# Altium schematic sheet Colibri.SchDoc: Iris
size A3; Organization: Toradex AG; Address1: Altsagenstrasse 5; Address2: Horw; Address3: 6048; Address4: Switzerland; DocumentNumber: 4; Revision: V2.0; SheetNumber: 4; SheetTotal: 16
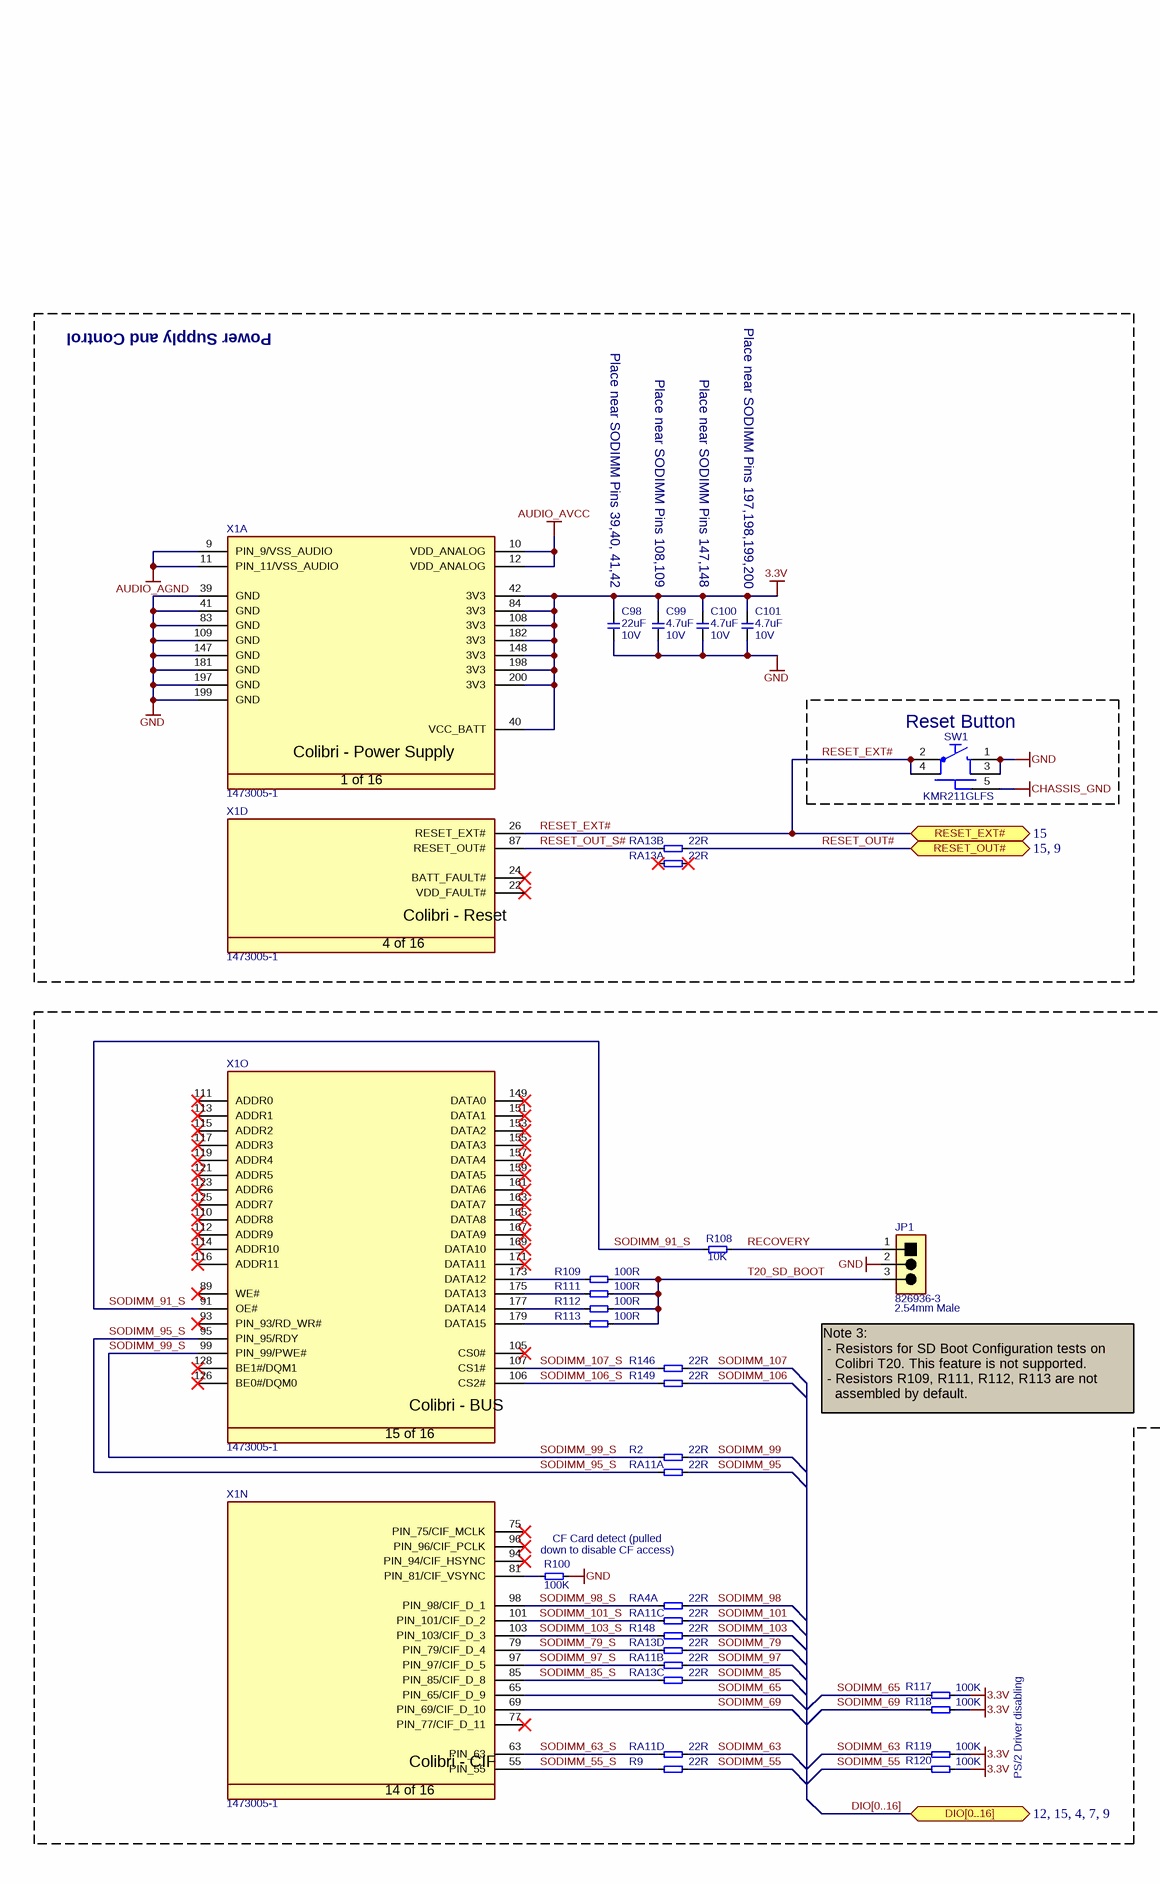
[diagram p0: Colibri.SchDoc, left]
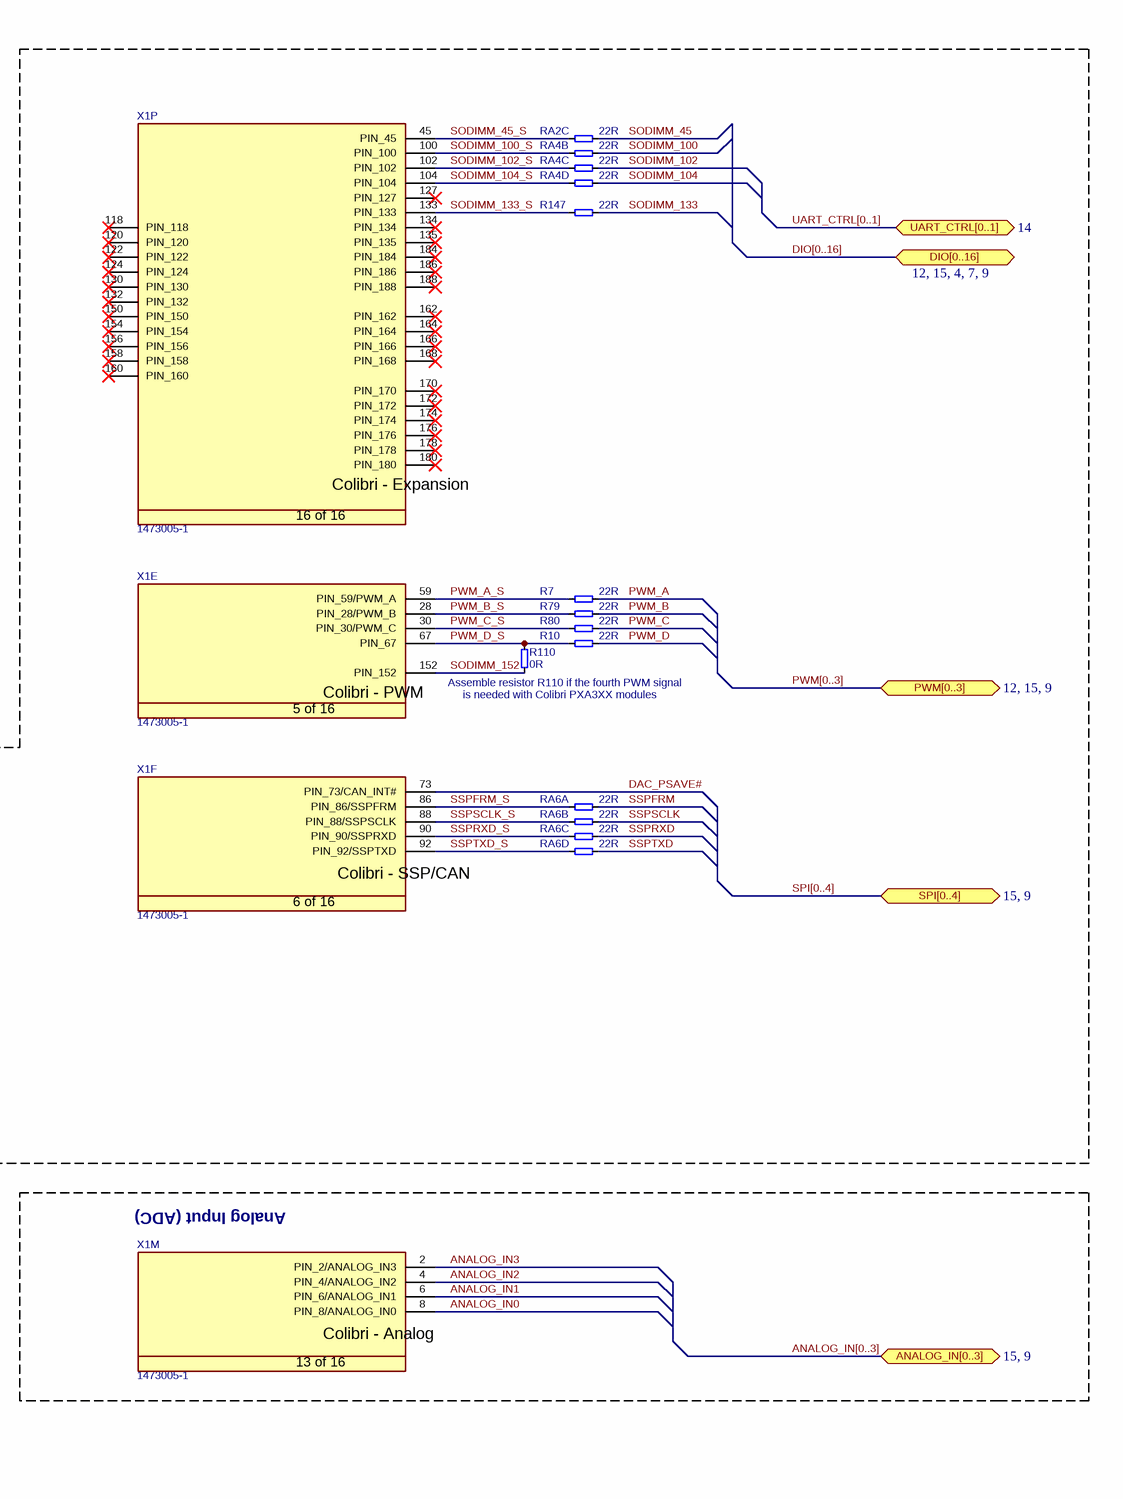
[diagram p1: Colibri.SchDoc, right]

## Parts
C98  Rating: 10V  [T_CAPC0805X125N]  (hidden comment: 22uF)
C99  Rating: 10V  [T_CAPC0603X33N]  (hidden comment: 4.7uF)
C100  Rating: 10V  [T_CAPC0603X33N]  (hidden comment: 4.7uF)
C101  Rating: 10V  [T_CAPC0603X33N]  (hidden comment: 4.7uF)
JP1  826936-3  [T_TYCO_826936-3]
R2  22R  [RESC1005X40N]
R7  22R  [RESC1005X40N]
R9  22R  [RESC1005X40N]
R10  22R  [RESC1005X40N]
R79  22R  [RESC1005X40N]
R80  22R  [RESC1005X40N]
R100  100K  [RESC1005X40N]
R108  10K  [RESC1005X40N]
R109  100R  [T_RESC0603X30N]
R110  0R  [T_RESC0603X30N]
R111  100R  [T_RESC0603X30N]
R112  100R  [T_RESC0603X30N]
R113  100R  [T_RESC0603X30N]
R117  100K  [RESC1005X40N]
R118  100K  [RESC1005X40N]
R119  100K  [RESC1005X40N]
R120  100K  [RESC1005X40N]
R146  22R  [RESC1005X40N]
R147  22R  [RESC1005X40N]
R148  22R  [RESC1005X40N]
R149  22R  [RESC1005X40N]
RA2  22R  [T_Resistor_Array_X4]  (part C of 4)
RA4  22R  [T_Resistor_Array_X4]  (parts A,B,C,D of 4)
RA6  22R  [T_Resistor_Array_X4]  (parts A,B,C,D of 4)
RA11  22R  [T_Resistor_Array_X4]  (parts A,B,C,D of 4)
RA13  22R  [T_Resistor_Array_X4]  (parts A,B,C,D of 4)
SW1  KMR211GLFS  [T_CnK_KMR211GLFS]
X1  1473005-1  [T_Tyco_1473005-1]  (parts A,D,E,F,M,N,O,P of 16)

## Blocks framed on the sheet
Power Supply and Control: C98-C101 RA13 X1
Reset Button: SW1
Analog Input (ADC): X1

## Ports
ANALOG_IN[0..3] (bidir, see 15, 9), DIO[0..16] (bidir, see 12, 15, 4, 7, 9), PWM[0..3] (bidir, see 12, 15, 9), RESET_EXT# (bidir, see 15), RESET_OUT# (bidir, see 15, 9), SPI[0..4] (bidir, see 15, 9), UART_CTRL[0..1] (bidir, see 14)

## Nets
3.3V: C98.2 C99.1 C100.1 C101.1 R117.1 R118.1 R119.1 R120.1 X1.40(VCC_BATT) X1.42(3V3) X1.84(3V3) X1.108(3V3) X1.148(3V3) X1.182(3V3) X1.198(3V3) X1.200(3V3)
AUDIO_AGND: X1.9(PIN_9/VSS_AUDIO) X1.11(PIN_11/VSS_AUDIO)
AUDIO_AVCC: X1.10(VDD_ANALOG) X1.12(VDD_ANALOG)
CHASSIS_GND: SW1.5
GND: C98.1 C99.2 C100.2 C101.2 JP1.2 R100.1 SW1.1 SW1.3 X1.39(GND) X1.41(GND) X1.83(GND) X1.109(GND) X1.147(GND) X1.181(GND) X1.197(GND) X1.199(GND)
ANALOG_IN0: X1.8(PIN_8/ANALOG_IN0)
ANALOG_IN1: X1.6(PIN_6/ANALOG_IN1)
ANALOG_IN2: X1.4(PIN_4/ANALOG_IN2)
ANALOG_IN3: X1.2(PIN_2/ANALOG_IN3)
DAC_PSAVE#: X1.73(PIN_73/CAN_INT#)
PWM_A: R7.2
PWM_A_S: R7.1 X1.59(PIN_59/PWM_A)
PWM_B: R79.2
PWM_B_S: R79.1 X1.28(PIN_28/PWM_B)
PWM_C: R80.2
PWM_C_S: R80.1 X1.30(PIN_30/PWM_C)
PWM_D: R10.2
PWM_D_S: R10.1 R110.1 X1.67(PIN_67)
RECOVERY: JP1.1 R108.2
RESET_EXT#: SW1.2 SW1.4 X1.26(RESET_EXT#) ; port RESET_EXT#
RESET_OUT#: RA13.6 ; port RESET_OUT#
RESET_OUT_S#: RA13.2 X1.87(RESET_OUT#)
SODIMM_45: RA2.7
SODIMM_45_S: RA2.3 X1.45(PIN_45)
SODIMM_55: R9.2 R120.2
SODIMM_55_S: R9.1 X1.55(PIN_55)
SODIMM_63: R119.2 RA11.8
SODIMM_63_S: RA11.4 X1.63(PIN_63)
SODIMM_65: R117.2 X1.65(PIN_65/CIF_D_9)
SODIMM_69: R118.2 X1.69(PIN_69/CIF_D_10)
SODIMM_79: RA13.8
SODIMM_79_S: RA13.4 X1.79(PIN_79/CIF_D_4)
SODIMM_85: RA13.7
SODIMM_85_S: RA13.3 X1.85(PIN_85/CIF_D_8)
SODIMM_91_S: R108.1 X1.91(OE#)
SODIMM_95: RA11.5
SODIMM_95_S: RA11.1 X1.95(PIN_95/RDY)
SODIMM_97: RA11.6
SODIMM_97_S: RA11.2 X1.97(PIN_97/CIF_D_5)
SODIMM_98: RA4.5
SODIMM_98_S: RA4.1 X1.98(PIN_98/CIF_D_1)
SODIMM_99: R2.2
SODIMM_99_S: R2.1 X1.99(PIN_99/PWE#)
SODIMM_100: RA4.6
SODIMM_100_S: RA4.2 X1.100(PIN_100)
SODIMM_101: RA11.7
SODIMM_101_S: RA11.3 X1.101(PIN_101/CIF_D_2)
SODIMM_102: RA4.7
SODIMM_102_S: RA4.3 X1.102(PIN_102)
SODIMM_103: R148.2
SODIMM_103_S: R148.1 X1.103(PIN_103/CIF_D_3)
SODIMM_104: RA4.8
SODIMM_104_S: RA4.4 X1.104(PIN_104)
SODIMM_106: R149.2
SODIMM_106_S: R149.1 X1.106(CS2#)
SODIMM_107: R146.2
SODIMM_107_S: R146.1 X1.107(CS1#)
SODIMM_133: R147.2
SODIMM_133_S: R147.1 X1.133(PIN_133)
SODIMM_152: R110.2 X1.152(PIN_152)
SSPFRM: RA6.5
SSPFRM_S: RA6.1 X1.86(PIN_86/SSPFRM)
SSPRXD: RA6.7
SSPRXD_S: RA6.3 X1.90(PIN_90/SSPRXD)
SSPSCLK: RA6.6
SSPSCLK_S: RA6.2 X1.88(PIN_88/SSPSCLK)
SSPTXD: RA6.8
SSPTXD_S: RA6.4 X1.92(PIN_92/SSPTXD)
T20_SD_BOOT: JP1.3 R109.1 R111.1 R112.1 R113.1
NetR100_2: R100.2 X1.81(PIN_81/CIF_VSYNC)
NetR109_2: R109.2 X1.173(DATA12)
NetR111_2: R111.2 X1.175(DATA13)
NetR112_2: R112.2 X1.177(DATA14)
NetR113_2: R113.2 X1.179(DATA15)

Not connected (* = marked no-connect by the designer): RA13 1* 5*; X1 22(VDD_FAULT#)* 24(BATT_FAULT#)* 75(PIN_75/CIF_MCLK)* 77(PIN_77/CIF_D_11)* 89(WE#)* 93(PIN_93/RD_WR#)* 94(PIN_94/CIF_HSYNC)* 96(PIN_96/CIF_PCLK)* 105(CS0#)* 110(ADDR8)* 111(ADDR0)* 112(ADDR9)* 113(ADDR1)* 114(ADDR10)* 115(ADDR2)* 116(ADDR11)* 117(ADDR3)* 118(PIN_118)* 119(ADDR4)* 120(PIN_120)* 121(ADDR5)* 122(PIN_122)* 123(ADDR6)* 124(PIN_124)* 125(ADDR7)* 126(BE0#/DQM0)* 127(PIN_127)* 128(BE1#/DQM1)* 130(PIN_130)* 132(PIN_132)* 134(PIN_134)* 135(PIN_135)* 149(DATA0)* 150(PIN_150)* 151(DATA1)* 153(DATA2)* 154(PIN_154)* 155(DATA3)* 156(PIN_156)* 157(DATA4)* 158(PIN_158)* 159(DATA5)* 160(PIN_160)* 161(DATA6)* 162(PIN_162)* 163(DATA7)* 164(PIN_164)* 165(DATA8)* 166(PIN_166)* 167(DATA9)* 168(PIN_168)* 169(DATA10)* 170(PIN_170)* 171(DATA11)* 172(PIN_172)* 174(PIN_174)* 176(PIN_176)* 178(PIN_178)* 180(PIN_180)* 184(PIN_184)* 186(PIN_186)* 188(PIN_188)*

## Buses and harness runs
bus ANALOG_IN[0..3] = port ANALOG_IN[0..3]
bus DIO[0..16] = port DIO[0..16]
bus PWM[0..3] = port PWM[0..3]
bus SPI[0..4] = port SPI[0..4]
bus UART_CTRL[0..1] = port UART_CTRL[0..1]

## Notes on the sheet
- Place near SODIMM Pins 39,40, 41,42
- Place near SODIMM Pins 197,198,199,200
- Place near SODIMM Pins 108,109
- Place near SODIMM Pins 147,148
- (near R110) Assemble resistor R110 if the fourth PWM signal
- (near R110) is needed with Colibri PXA3XX modules
- (near JP1) 2.54mm Male
- (near JP1) Note 3:
  - Resistors for SD Boot Configuration tests on
  Colibri T20. This feature is not supported.
  - Resistors R109, R111, R112, R113 are not
  assembled by default.
- (near R100) down to disable CF access)
- (near R100) CF Card detect (pulled
- PS/2 Driver disabling
- Title
- Size:
- Date:
- A3
- Number:
- Time:
- Revision:
- Sheet
- of
- File:
- (in symbol CON-Tyco-1473005-1-200-0.6mm, part A) Colibri - Power Supply; 1 of 16
- (in symbol CON-Tyco-1473005-1-200-0.6mm, part D) Colibri - Reset; 4 of 16
- (in symbol CON-Tyco-1473005-1-200-0.6mm, part E) Colibri - PWM; 5 of 16
- (in symbol CON-Tyco-1473005-1-200-0.6mm, part F) Colibri - SSP/CAN; 6 of 16
- (in symbol CON-Tyco-1473005-1-200-0.6mm, part M) Colibri - Analog; 13 of 16
- (in symbol CON-Tyco-1473005-1-200-0.6mm, part N) Colibri - CIF; 14 of 16
- (in symbol CON-Tyco-1473005-1-200-0.6mm, part O) Colibri - BUS; 15 of 16
- (in symbol CON-Tyco-1473005-1-200-0.6mm, part P) Colibri - Expansion; 16 of 16

## Library data of the parts
C98 = C-X5R-22uF-10V-20%-0805: Capacitor Ceramic X5R 22uF 10V 20% 0805; Tolerance: 20%; Type: X5R; Value: 22uF
C99-C101 = C-X5R-4.7uF-10V-10%-0603: Capacitor Ceramic X5R 4.7uF 10V 10% 0603; Manufacturer Name: Generic; Tolerance: 10%; Type: X5R; Value: 4.7uF; Manufacturer Part No.: *
JP1 = CON-Tyco-826936-3-1X3-2.54mm-JP: Jumper, 3-Pin; Manufacturer Name: Tyco; No. of ways: 1X3; Pitch: 2.54mm; Manufacturer Part No.: 826936-3
R2 R7 R9 R10 R79 R80 R146-R149 = R-22R-63mW-5%-0402: Resistor 22 ohm 63mW 5% 0402; Rating: 63mW; Tolerance: 5%; Value: 22R
R100 R117-R120 = R-100KR-63mW-5%-0402: Resistor 100 Kohm 63mW 5% 0402; Value: 100KR; Rating: 63mW; Tolerance: 5%
R108 = R-10KR-63mW-1%-0402: Resistor 10 Kohm 63mW 1% 0402; Value: 10KR; Rating: 63mW; Tolerance: 1%
R109 R111-R113 = R-100R-63mW-5%-0603: Resistor 100 ohm 63mW 5% 0603; Rating: 63mW; Tolerance: 5%; Value: 100R
R110 = R-0R-63mW-5%-0603: Resistor 0 ohm 63mW 5% 0603; Rating: 63mW; Tolerance: 5%; Value: 0R; Size: 0603 (In)
RA2 RA4 RA6 RA11 RA13 = RA-22R-63mW-5%-1206-div: Resistor Array 22 R 63mW 5% 1206; Manufacturer Name: Generic; Tolerance: 5%; Power Dissipation: 63mW; Manufacturer Part Number: *; Value: 22R
SW1 = SW_CnK-KMR211GLFS-1VA: Power ON Switch; Manufacturer Name: C&N; Rating: 1VA; Manufacturer Part No.: KMR211GLFS
X1 = CON-Tyco-1473005-1-200-0.6mm: SODIMM Connector; Manufacturer Name: Tyco; No. of ways: 200; Manufacturer Part No.: 1473005-1